# EAGLE schematic 1wire_slave_long (EAGLE 7.7.0)
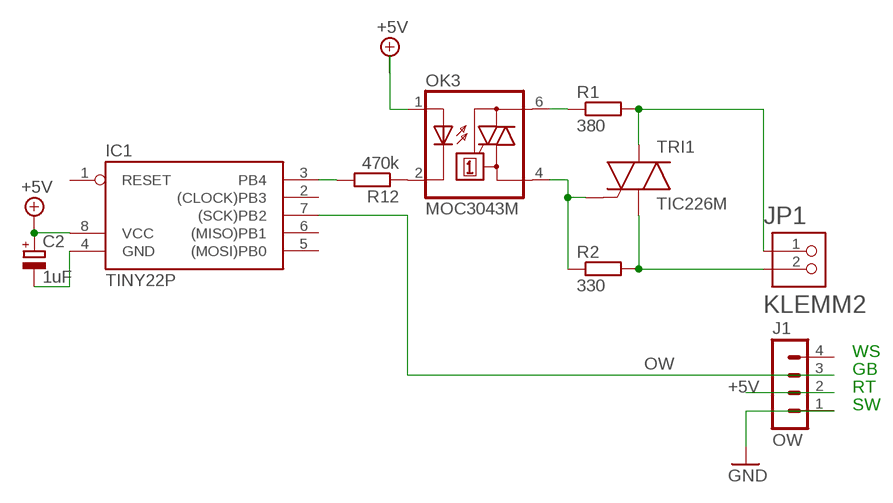
[diagram p0: schematic, sheet 1]

## Parts
C2  1uF  CPOL-EUE2,5-6E  [E2,5-6E]
IC1  TINY22P  [DIL08]
J1  OW  MA04-1  [MA04-1]
JP1  KLEMM2  [KLEMM2]
OK3  MOC3043M  [DIL06]
R1  380  R-EU_0204/7  [0204/7]
R2  330  R-EU_0204/7  [0204/7]
R12  470k  R-EU_0204/7  [0204/7]
TRI1  TIC226M  [TO-220A]

## Nets
+5V: C2.+ IC1.8(VCC) J1.2 OK3.1(A)
GND: C2.- IC1.4(GND) J1.1
N$1: JP1.2 R2.2 TRI1.1(A1)
N$3: JP1.1 R1.2 TRI1.2(A2)
N$4: IC1.3(PB4) R12.2
N$6: OK3.4(A1) R2.1 TRI1.3(G)
N$8: OK3.6(A2) R1.1
N$9: OK3.2(C) R12.1
OW: IC1.7((SCK)PB2) J1.3
Unconnected: IC1.1(RESET) IC1.2((CLOCK)PB3) IC1.5((MOSI)PB0) IC1.6((MISO)PB1) J1.4

## Notes on the sheet
- WS
- GB
- RT
- SW

## Library data of the parts
C2 = resistor:CPOL-EU: POLARIZED CAPACITOR, European symbol
IC1 = atmel:TINY22: MICROCONTROLLER 1K ROM 128 bytes RAM 128 bytes EEPROM; OC_FARNELL: unknown; OC_NEWARK: unknown
J1 = con-lstb:MA04-1: PIN HEADER; OC_FARNELL: unknown; OC_NEWARK: unknown
JP1 = PINHEAD:KLEMM2
OK3 = optocoupler:MOC30*: 6-Pin DIP Zero-Cross Optoisolators Triac Driver Output (250/400 Volt Peak) Source: Data sheet <http://www.fairchildsemi.com/ds/MO/MOC3031M.pdf> The old path of data sheet not more available 2013-05-06.; MF: FAIRCHILD SEMICONDUCTOR; MPN: MOC3043-M; OC_FARNELL: 1021371; OC_NEWARK: 72K8900
R1 R2 = resistor:R-EU_: RESISTOR, European symbol
R12 = rcl:R-EU_: RESISTOR, European symbol
TRI1 = SEMICON:TIC226M